# Altium schematic sheet pressure.SchDoc: Pressure Sensors
size A4; Organization: Badgerloop Electrical; Address1: 133 Engineering Research Building; Address2: 1500 Engineering Drive; Address3: Madison, Wi 53706
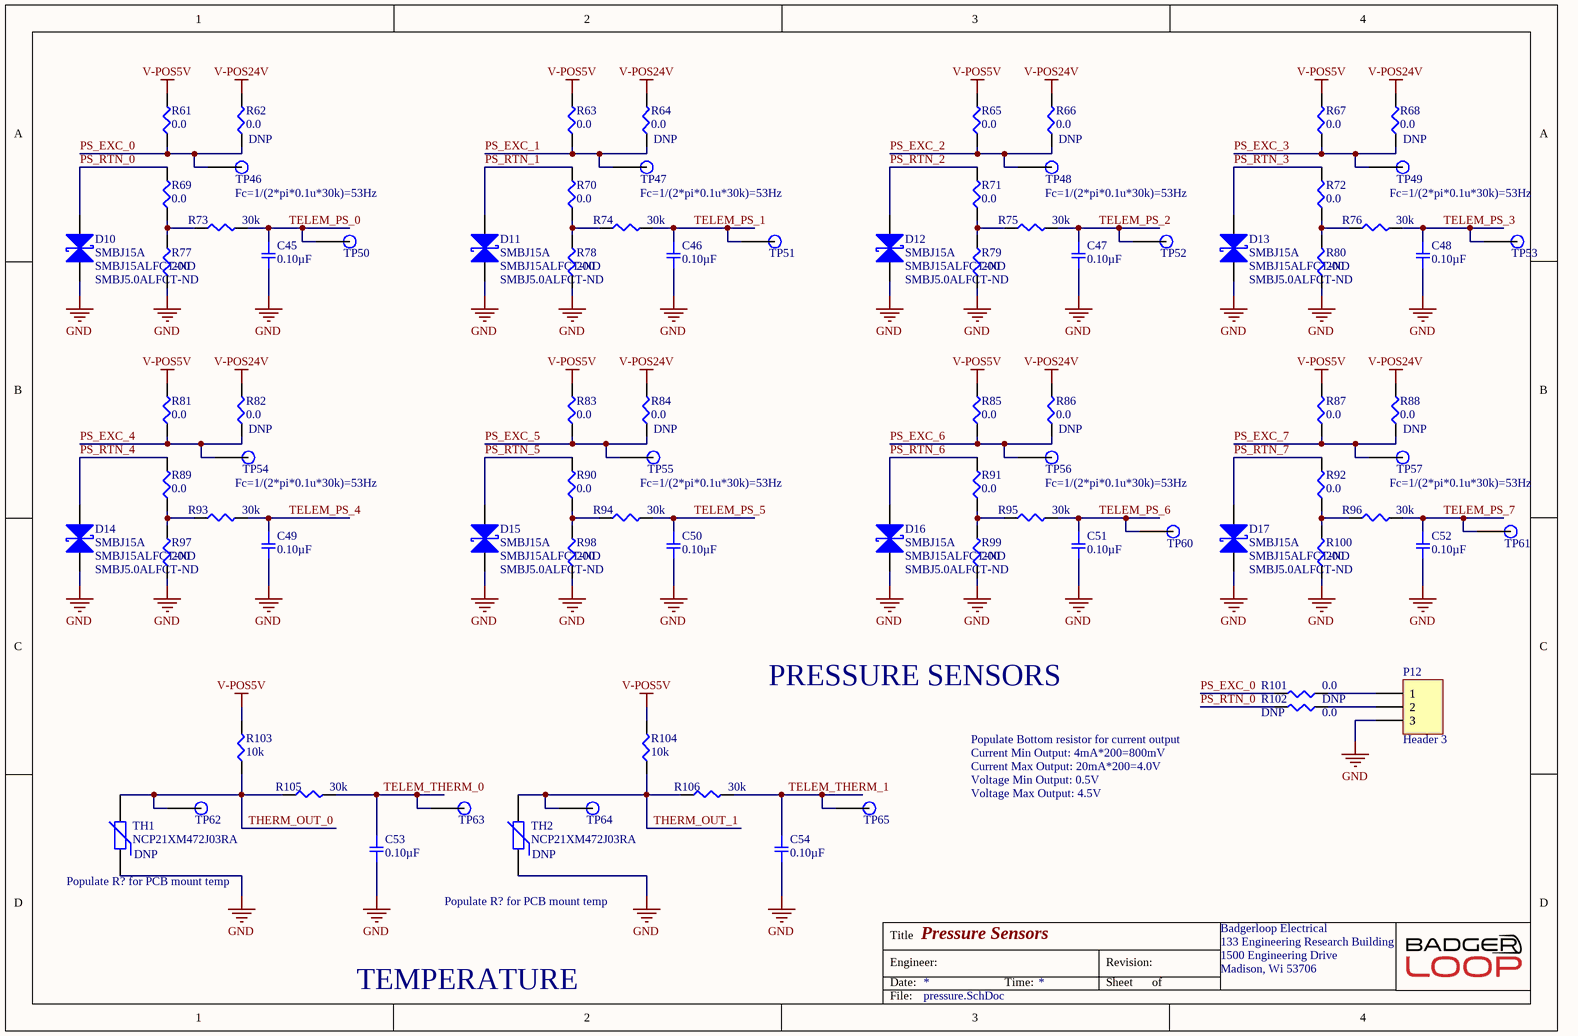
[diagram p0: pressure.SchDoc]

## Parts
C45  0.10µF  [SMD-0805C]
C46  0.10µF  [SMD-0805C]
C47  0.10µF  [SMD-0805C]
C48  0.10µF  [SMD-0805C]
C49  0.10µF  [SMD-0805C]
C50  0.10µF  [SMD-0805C]
C51  0.10µF  [SMD-0805C]
C52  0.10µF  [SMD-0805C]
C53  0.10µF  [SMD-0805C]
C54  0.10µF  [SMD-0805C]
D10  SMBJ15A  Supplier Part Number 1: SMBJ15ALFCT-ND  Supplier Part Number 2: SMBJ5.0ALFCT-ND  [DIOM4436X26N]
D11  SMBJ15A  Supplier Part Number 1: SMBJ15ALFCT-ND  Supplier Part Number 2: SMBJ5.0ALFCT-ND  [DIOM4436X26N]
D12  SMBJ15A  Supplier Part Number 1: SMBJ15ALFCT-ND  Supplier Part Number 2: SMBJ5.0ALFCT-ND  [DIOM4436X26N]
D13  SMBJ15A  Supplier Part Number 1: SMBJ15ALFCT-ND  Supplier Part Number 2: SMBJ5.0ALFCT-ND  [DIOM4436X26N]
D14  SMBJ15A  Supplier Part Number 1: SMBJ15ALFCT-ND  Supplier Part Number 2: SMBJ5.0ALFCT-ND  [DIOM4436X26N]
D15  SMBJ15A  Supplier Part Number 1: SMBJ15ALFCT-ND  Supplier Part Number 2: SMBJ5.0ALFCT-ND  [DIOM4436X26N]
D16  SMBJ15A  Supplier Part Number 1: SMBJ15ALFCT-ND  Supplier Part Number 2: SMBJ5.0ALFCT-ND  [DIOM4436X26N]
D17  SMBJ15A  Supplier Part Number 1: SMBJ15ALFCT-ND  Supplier Part Number 2: SMBJ5.0ALFCT-ND  [DIOM4436X26N]
P12  Header 3  [Pin Header 1x3 TH Pitch 2.54mm]
R61  0.0  [SMD-0805-RES]
R62  0.0  [SMD-0805-RES]
R63  0.0  [SMD-0805-RES]
R64  0.0  [SMD-0805-RES]
R65  0.0  [SMD-0805-RES]
R66  0.0  [SMD-0805-RES]
R67  0.0  [SMD-0805-RES]
R68  0.0  [SMD-0805-RES]
R69  0.0  [SMD-0805-RES]
R70  0.0  [SMD-0805-RES]
R71  0.0  [SMD-0805-RES]
R72  0.0  [SMD-0805-RES]
R73  30k  [SMD-0805-RES]
R74  30k  [SMD-0805-RES]
R75  30k  [SMD-0805-RES]
R76  30k  [SMD-0805-RES]
R77  200  [SMD-0805-RES]
R78  200  [SMD-0805-RES]
R79  200  [SMD-0805-RES]
R80  200  [SMD-0805-RES]
R81  0.0  [SMD-0805-RES]
R82  0.0  [SMD-0805-RES]
R83  0.0  [SMD-0805-RES]
R84  0.0  [SMD-0805-RES]
R85  0.0  [SMD-0805-RES]
R86  0.0  [SMD-0805-RES]
R87  0.0  [SMD-0805-RES]
R88  0.0  [SMD-0805-RES]
R89  0.0  [SMD-0805-RES]
R90  0.0  [SMD-0805-RES]
R91  0.0  [SMD-0805-RES]
R92  0.0  [SMD-0805-RES]
R93  30k  [SMD-0805-RES]
R94  30k  [SMD-0805-RES]
R95  30k  [SMD-0805-RES]
R96  30k  [SMD-0805-RES]
R97  200  [SMD-0805-RES]
R98  200  [SMD-0805-RES]
R99  200  [SMD-0805-RES]
R100  200  [SMD-0805-RES]
R101  0.0  [SMD-0805-RES]
R102  0.0  [SMD-0805-RES]
R103  10k  [SMD-0805-RES]
R104  10k  [SMD-0805-RES]
R105  30k  [SMD-0805-RES]
R106  30k  [SMD-0805-RES]
TH1  NCP21XM472J03RA  [SMD-0805-RES]
TH2  NCP21XM472J03RA  [SMD-0805-RES]
TP46  TP  [Test Point]  (value not drawn)
TP47  TP  [Test Point]  (value not drawn)
TP48  TP  [Test Point]  (value not drawn)
TP49  TP  [Test Point]  (value not drawn)
TP50  TP  [Test Point]  (value not drawn)
TP51  TP  [Test Point]  (value not drawn)
TP52  TP  [Test Point]  (value not drawn)
TP53  TP  [Test Point]  (value not drawn)
TP54  TP  [Test Point]  (value not drawn)
TP55  TP  [Test Point]  (value not drawn)
TP56  TP  [Test Point]  (value not drawn)
TP57  TP  [Test Point]  (value not drawn)
TP60  TP  [Test Point]  (value not drawn)
TP61  TP  [Test Point]  (value not drawn)
TP62  TP  [Test Point]  (value not drawn)
TP63  TP  [Test Point]  (value not drawn)
TP64  TP  [Test Point]  (value not drawn)
TP65  TP  [Test Point]  (value not drawn)

## Nets
GND: C45.2 C46.2 C47.2 C48.2 C49.2 C50.2 C51.2 C52.2 C53.2 C54.2 D10.1(A) D11.1(A) D12.1(A) D13.1(A) D14.1(A) D15.1(A) D16.1(A) D17.1(A) P12.3 R77.1 R78.1 R79.1 R80.1 R97.1 R98.1 R99.1 R100.1 TH1.1 TH2.1
V-POS5V: R61.2 R63.2 R65.2 R67.2 R81.2 R83.2 R85.2 R87.2 R103.2 R104.2
V-POS24V: R62.2 R64.2 R66.2 R68.2 R82.2 R84.2 R86.2 R88.2
PS_EXC_0: R61.1 R62.1 R101.2 TP46.1
PS_EXC_1: R63.1 R64.1 TP47.1
PS_EXC_2: R65.1 R66.1 TP48.1
PS_EXC_3: R67.1 R68.1 TP49.1
PS_EXC_4: R81.1 R82.1 TP54.1
PS_EXC_5: R83.1 R84.1 TP55.1
PS_EXC_6: R85.1 R86.1 TP56.1
PS_EXC_7: R87.1 R88.1 TP57.1
PS_RTN_0: D10.2(K) R69.2 R102.2
PS_RTN_1: D11.2(K) R70.2
PS_RTN_2: D12.2(K) R71.2
PS_RTN_3: D13.2(K) R72.2
PS_RTN_4: D14.2(K) R89.2
PS_RTN_5: D15.2(K) R90.2
PS_RTN_6: D16.2(K) R91.2
PS_RTN_7: D17.2(K) R92.2
TELEM_PS_0: C45.1 R73.2 TP50.1
TELEM_PS_1: C46.1 R74.2 TP51.1
TELEM_PS_2: C47.1 R75.2 TP52.1
TELEM_PS_3: C48.1 R76.2 TP53.1
TELEM_PS_4: C49.1 R93.2
TELEM_PS_5: C50.1 R94.2
TELEM_PS_6: C51.1 R95.2 TP60.1
TELEM_PS_7: C52.1 R96.2 TP61.1
TELEM_THERM_0: C53.1 R105.2 TP63.1
TELEM_THERM_1: C54.1 R106.2 TP65.1
THERM_OUT_0: R103.1 R105.1 TH1.2 TP62.1
THERM_OUT_1: R104.1 R106.1 TH2.2 TP64.1
NetP12_1: P12.1 R101.1
NetP12_2: P12.2 R102.1
NetR69_1: R69.1 R73.1 R77.2
NetR70_1: R70.1 R74.1 R78.2
NetR71_1: R71.1 R75.1 R79.2
NetR72_1: R72.1 R76.1 R80.2
NetR89_1: R89.1 R93.1 R97.2
NetR90_1: R90.1 R94.1 R98.2
NetR91_1: R91.1 R95.1 R99.2
NetR92_1: R92.1 R96.1 R100.2

## Notes on the sheet
- Fc=1/(2*pi*0.1u*30k)=53Hz
- PRESSURE SENSORS
- Populate Bottom resistor for current output
- Current Min Output: 4mA*200=800mV
- Current Max Output: 20mA*200=4.0V
- Voltage Min Output: 0.5V
- Voltage Max Output: 4.5V
- (near TH1) Populate R? for PCB mount temp
- (near TH2) Populate R? for PCB mount temp
- TEMPERATURE
- Title
- Engineer:
- Date:
- Time:
- Revision:
- Sheet
- of
- File:

## Library data of the parts
C45-C52 = GRM219R71E104KA01D: CAP CER 0.1UF 25V X7R 0805; Manufacturer: Murata Electronics North America; Factory Stock: 0; Unit Price (USD): 0.12; Minimum Quantity: 1; Tolerance: ±10%; Datasheets: http://www.murata.com/~/media/webrenewal/support/library/catalog/products/capacitor/mlcc/c02e.pdf; Image: //media.digikey.com/Renders/Murata%20Renders/0805%20(2012%20Metric)%20.85mm.jpg; Digi-Key Part Number: 490-12754-1-ND; Part Number: GRM219R71E104KA01D; Quantity Available: 8594; @ qty: 0; Packaging: Cut Tape (CT); Series: GRM; Part Status: Active; Value: 0.10µF; Voltage: 25V; Temperature Coefficient: X7R; Operating Temperature: -55°C ~ 125°C; Features: -; Ratings: -; Applications: General Purpose; Mounting Type: Surface Mount, MLCC; Package / Case: 0805 (2012 Metric); Size / Dimension: 0.079" L x 0.049" W (2.00mm x 1.25mm); Height - Seated (Max): -; Thickness (Max): 0.037" (0.95mm); Lead Spacing: -; Lead Style: -
C53 C54 = GRM219R71C104KA01D: CAP CER 0.1UF 16V X7R 0805; Manufacturer: Murata Electronics North America; Factory Stock: 0; Unit Price (USD): 0.13; Minimum Quantity: 1; Tolerance: ±10%; Datasheets: http://www.murata.com/~/media/webrenewal/support/library/catalog/products/capacitor/mlcc/c02e.pdf; Image: //media.digikey.com/Renders/Murata%20Renders/0805%20(2012%20Metric)%20.85mm.jpg; Digi-Key Part Number: 490-1683-1-ND; Part Number: GRM219R71C104KA01D; Quantity Available: 265464; @ qty: 0; Packaging: Cut Tape (CT); Series: GRM; Part Status: Active; Value: 0.10µF; Voltage: 16V; Temperature Coefficient: X7R; Operating Temperature: -55°C ~ 125°C; Features: -; Ratings: -; Applications: General Purpose; Mounting Type: Surface Mount, MLCC; Package / Case: 0805 (2012 Metric); Size / Dimension: 0.079" L x 0.049" W (2.00mm x 1.25mm); Height - Seated (Max): -; Thickness (Max): 0.037" (0.95mm); Lead Spacing: -; Lead Style: -
D10-D17 = SMBJ15A: TVS DIODE 15V 24.4V DO214AA; Manufacturer: Littelfuse; Direction: Unidirectional; Min Breakdown Voltage: 16.7V; Peak Pulse Power: 600W; Peak Pulse Current: 24.6A; Test Current: 1mA; Number of Elements: 1; Power Line Protection: No; Max Breakdown Voltage: 18.5V; Max Reverse Leakage Current: 1uA; Max Power Dissipation: 5W; Element Configuration: Single; Description: TVS DIODE 5V 9.2V DO214AA; ESD Protection: Yes; Current: 68A; Voltage: 5V; Supplier 1: Digi-Key; Manufacturer Part Number: SMBJ15A; Stock 1: 73945; Pricing 1: 1=0.45000, 10=0.33900, 25=0.30520, 100=0.21090, 250=0.17760, 500=0.14430, 1000=0.11100 (USD); RoHS: Yes; Mount: Surface Mount; Case/Package: SMB; Number of Pins: 2; Min Operating Temperature: -65°C; Max Operating Temperature: 150°C; Packaging: Tape and Reel; Reverse Standoff Voltage: 15V; Clamping Voltage: 24.4V; Power Dissipation: 600W; Voltage Rating (DC): 15V; Reverse Breakdown Voltage: 16.7V; Package Quantity: 3000; Operating Supply Voltage: 15V; Max Surge Current: 24.6A; Number of Unidirectional Channels: 1; Breakdown Voltage: 16.7V; Number of Channels: 1; Polarity: Unidirectional; Termination: SMD/SMT; Leakage Current: 1uA; Composition: Zener; Length: 4.57mm; Height: 2.237mm; Width: 3.94mm; Radiation Hardening: No; Lead Free: Lead Free; REACH SVHC: Unknown; ComponentLink1URL: https://datasheet.ciiva.com/34301/1078555-34301957.pdf?src-supplier=Jameco; ComponentLink1Description: https://datasheet.ciiva.com/34301/1078555-34301957.pdf?src-supplier=Jameco; ComponentLink2URL: https://datasheet.ciiva.com/25624/0900766b810f4eeb-25624826.pdf?src-supplier=RSComponents; ComponentLink2Description: https://datasheet.ciiva.com/25624/0900766b810f4eeb-25624826.pdf?src-supplier=RSComponents; ComponentLink3URL: https://datasheet.ciiva.com/46385/13057-46385079.pdf?src-supplier=Element14; ComponentLink3Description: https://datasheet.ciiva.com/46385/13057-46385079.pdf?src-supplier=Element14; ComponentLink4URL: https://datasheet.ciiva.com/331/littelfuse-tvs-diode-smbj-datasheet-pdf-331176.pdf?src-supplier=Digi-Key; ComponentLink4Description: https://datasheet.ciiva.com/331/littelfuse-tvs-diode-smbj-datasheet-pdf-331176.pdf?src-supplier=Digi-Key; ComponentLink5URL: https://datasheet.ciiva.com/331/littelfuse-tvs-diode-smbj-datasheet-pdf-331177.pdf?src-supplier=Digi-Key; ComponentLink5Description: https://datasheet.ciiva.com/331/littelfuse-tvs-diode-smbj-datasheet-pdf-331177.pdf?src-supplier=Digi-Key; ComponentLink6URL: https://datasheet.ciiva.com/331/littelfuse-tvs-diode-smbj-datasheet-pdf-331178.pdf?src-supplier=Digi-Key; ComponentLink6Description: https://datasheet.ciiva.com/331/littelfuse-tvs-diode-smbj-datasheet-pdf-331178.pdf?src-supplier=Digi-Key; Supplier 2: Digi-Key; Stock 2: 69911; Pricing 2: 1=0.35000, 10=0.28700, 25=0.26240, 100=0.19540, 250=0.17704, 500=0.14652, 1000=0.10989 (USD); ComponentLink7URL: https://datasheet.ciiva.com/25624/0900766b810f4eeb-25624712.pdf?src-supplier=RSComponents; ComponentLink7Description: https://datasheet.ciiva.com/25624/0900766b810f4eeb-25624712.pdf?src-supplier=RSComponents; ComponentLink8URL: https://datasheet.ciiva.com/34302/1546929-34302459.pdf?src-supplier=Jameco; ComponentLink8Description: https://datasheet.ciiva.com/34302/1546929-34302459.pdf?src-supplier=Jameco; ComponentLink9URL: https://datasheet.ciiva.com/46381/1677318-46381958.pdf?src-supplier=Element14; ComponentLink9Description: https://datasheet.ciiva.com/46381/1677318-46381958.pdf?src-supplier=Element14; ComponentLink10URL: https://datasheet.ciiva.com/331/littelfuse-tvs-diode-smbj-datasheet-pdf-331131.pdf?src-supplier=Digi-Key; ComponentLink10Description: https://datasheet.ciiva.com/331/littelfuse-tvs-diode-smbj-datasheet-pdf-331131.pdf?src-supplier=Digi-Key; ComponentLink11URL: https://datasheet.ciiva.com/331/littelfuse-tvs-diode-smbj-datasheet-pdf-331132.pdf?src-supplier=Digi-Key; ComponentLink11Description: https://datasheet.ciiva.com/331/littelfuse-tvs-diode-smbj-datasheet-pdf-331132.pdf?src-supplier=Digi-Key; ComponentLink12URL: https://datasheet.ciiva.com/331/littelfuse-tvs-diode-smbj-datasheet-pdf-331133.pdf?src-supplier=Digi-Key; ComponentLink12Description: https://datasheet.ciiva.com/331/littelfuse-tvs-diode-smbj-datasheet-pdf-331133.pdf?src-supplier=Digi-Key
P12 = Header 3: Header, 3-Pin; LatestRevisionDate: 17-Jul-2002; LatestRevisionNote: Re-released for DXP Platform.; Publisher: Altium Limited
R61-R72 R81-R92 R101 R102 = ERJ-6GEY0R00V: RES SMD 0.0 OHM JUMPER 1/8W 0805; Manufacturer: Panasonic Electronic Components; Factory Stock: 0; Unit Price (USD): 0.00544; @ qty: 1500; Minimum Quantity: 1; Power (Watts): 0.125W, 1/8W; Part Number: ERJ-6GEY0R00V; Datasheets: http://industrial.panasonic.com/www-cgi/jvcr13pz.cgi?E+PZ+3+AOA0001+ERJ6GEY0R00V+7+WW; Image: //media.digikey.com/Renders/Panasonic%20Renders/ERJ-0805%20Pkg.jpg; Digi-Key Part Number: P0.0ACT-ND; Quantity Available: 1597627; Packaging: Cut Tape (CT); Series: ERJ; Part Status: Active; Value: 0.0; Tolerance: Jumper; Composition: Thick Film; Features: Automotive AEC-Q200; Temperature Coefficient: -; Operating Temperature: -55°C ~ 155°C; Package / Case: 0805 (2012 Metric); Supplier Device Package: 0805; Size / Dimension: 0.079" L x 0.049" W (2.00mm x 1.25mm); Height - Seated (Max): 0.028" (0.70mm); Number of Terminations: 2; Failure Rate: -
  R62 R64 R66 R68 R82 R84 R86 R88 R101 R102: DNP: DNP
R73-R76 R93-R96 R105 R106 = ERJ-6ENF3002V: RES SMD 30K OHM 1% 1/8W 0805; Manufacturer: Panasonic Electronic Components; Factory Stock: 0; Unit Price (USD): 0.00729; @ qty: 1500; Minimum Quantity: 1; Power (Watts): 0.125W, 1/8W; Temperature Coefficient: ±100ppm/°C; Part Number: ERJ-6ENF3002V; Datasheets: http://industrial.panasonic.com/www-cgi/jvcr13pz.cgi?E+PZ+3+AOA0002+ERJ6ENF3002V+7+WW; Image: //media.digikey.com/Renders/Panasonic%20Renders/ERJ-0805%20Pkg.jpg; Digi-Key Part Number: P30.0KCCT-ND; Quantity Available: 88046; Packaging: Cut Tape (CT); Series: ERJ; Part Status: Active; Value: 30k; Tolerance: ±1%; Composition: Thick Film; Features: Automotive AEC-Q200; Operating Temperature: -55°C ~ 155°C; Package / Case: 0805 (2012 Metric); Supplier Device Package: 0805; Size / Dimension: 0.079" L x 0.049" W (2.00mm x 1.25mm); Height - Seated (Max): 0.028" (0.70mm); Number of Terminations: 2; Failure Rate: -
R77-R80 R97-R100 = ERJ-P06F2000V: RES SMD 200 OHM 1% 1/2W 0805; Manufacturer: Panasonic Electronic Components; Factory Stock: 0; Unit Price (USD): 0.02534; @ qty: 1500; Minimum Quantity: 1; Power (Watts): 0.5W, 1/2W; Temperature Coefficient: ±100ppm/°C; Part Number: ERJ-P06F2000V; Datasheets: https://industrial.panasonic.com/cdbs/www-data/pdf/RDA0000/AOA0000C243.pdf; Image: //media.digikey.com/Renders/Panasonic%20Renders/ERJ-0805%20Pkg.jpg; Digi-Key Part Number: P16064CT-ND; Quantity Available: 14258; Packaging: Cut Tape (CT); Series: ERJ; Part Status: Active; Value: 200; Tolerance: ±1%; Composition: Thick Film; Features: Automotive AEC-Q200, Pulse Withstanding; Operating Temperature: -55°C ~ 155°C; Package / Case: 0805 (2012 Metric); Supplier Device Package: 0805; Size / Dimension: 0.079" L x 0.049" W (2.00mm x 1.25mm); Height - Seated (Max): 0.028" (0.70mm); Number of Terminations: 2; Failure Rate: -
R103 R104 = ERJ-P06F1002V: RES SMD 10K OHM 1% 1/2W 0805; Manufacturer: Panasonic Electronic Components; Factory Stock: 0; Unit Price (USD): 0.02534; @ qty: 1500; Minimum Quantity: 1; Power (Watts): 0.5W, 1/2W; Temperature Coefficient: ±100ppm/°C; Part Number: ERJ-P06F1002V; Datasheets: https://industrial.panasonic.com/cdbs/www-data/pdf/RDA0000/AOA0000C243.pdf; Image: //media.digikey.com/Renders/Panasonic%20Renders/ERJ-0805%20Pkg.jpg; Digi-Key Part Number: P16059CT-ND; Quantity Available: 42054; Packaging: Cut Tape (CT); Series: ERJ; Part Status: Active; Value: 10k; Tolerance: ±1%; Composition: Thick Film; Features: Automotive AEC-Q200, Pulse Withstanding; Operating Temperature: -55°C ~ 155°C; Package / Case: 0805 (2012 Metric); Supplier Device Package: 0805; Size / Dimension: 0.079" L x 0.049" W (2.00mm x 1.25mm); Height - Seated (Max): 0.028" (0.70mm); Number of Terminations: 2; Failure Rate: -
TH1 TH2 = NCP21XM472J03RA: NTC THERMISTOR 4.7K OHM 5% 0805; Manufacturer: Murata; Resistance: 4.7kR; Power Rating: 200mW; Current Rating: 650uA; Accuracy: 3%; Supplier 1: Digi-Key; Manufacturer Part Number: NCP21XM472J03RA; Stock 1: 51855; Pricing 1: 1=0.20000, 5=0.19400, 10=0.17300, 25=0.15920, 50=0.12760, 100=0.10930, 500=0.09564, 1000=0.08197 (USD); RoHS: Yes; Mount: Surface Mount; Case/Package: 0805; Number of Pins: 2; Case Code (Metric): 2012; Case Code (Imperial): 0805; Min Operating Temperature: -40°C; Max Operating Temperature: 125°C; Tolerance: 5%; Packaging: Tape and Reel; Package Quantity: 4000; Max Power Dissipation: 200mW; Termination: SMD/SMT; Length: 2mm; Height: 0.85mm; Depth: 1.25mm; Width: 1.25mm; Radiation Hardening: No; REACH SVHC: No SVHC; Lead Free: Lead Free; ComponentLink1URL: https://datasheet.ciiva.com/30488/0900766b81259d06-30488337.pdf?src-supplier=RSComponents; ComponentLink1Description: https://datasheet.ciiva.com/30488/0900766b81259d06-30488337.pdf?src-supplier=RSComponents; ComponentLink2URL: https://datasheet.ciiva.com/2848/r44e-2848550.pdf?src-supplier=Digi-Key; ComponentLink2Description: https://datasheet.ciiva.com/2848/r44e-2848550.pdf?src-supplier=Digi-Key; ComponentLink3URL: https://datasheet.ciiva.com/24155/r44e-24155222.pdf?src-supplier=Future+Electronics; ComponentLink3Description: https://datasheet.ciiva.com/24155/r44e-24155222.pdf?src-supplier=Future+Electronics; ComponentLink4URL: https://datasheet.ciiva.com/2848/r44e-2848551.pdf?src-supplier=Digi-Key; ComponentLink4Description: https://datasheet.ciiva.com/2848/r44e-2848551.pdf?src-supplier=Digi-Key; ComponentLink5URL: https://datasheet.ciiva.com/2848/r44e-2848552.pdf?src-supplier=Digi-Key; ComponentLink5Description: https://datasheet.ciiva.com/2848/r44e-2848552.pdf?src-supplier=Digi-Key; ComponentLink6URL: https://datasheet.ciiva.com/16634/l0770c-16634105.pdf?src-supplier=Avnet+Europe; ComponentLink6Description: https://datasheet.ciiva.com/16634/l0770c-16634105.pdf?src-supplier=Avnet+Europe; ComponentLink7URL: https://datasheet.ciiva.com/3280/l0770c-3280522.pdf?src-supplier=Avnet; ComponentLink7Description: https://datasheet.ciiva.com/3280/l0770c-3280522.pdf?src-supplier=Avnet; Supplier Part Number 1: 490-2453-1-ND; DNP: DNP
TP46-TP57 TP60-TP65 = TP: SMD TEST POINT